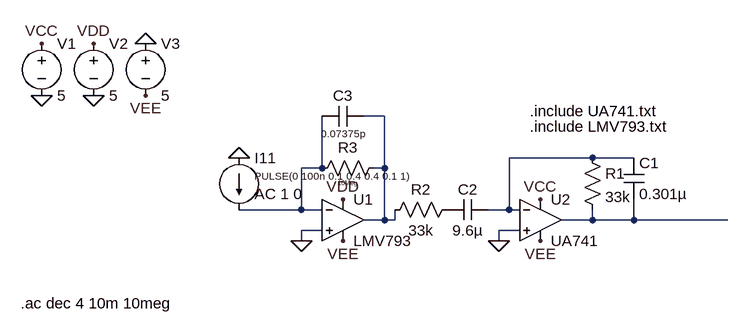
[diagram p0: schematic Draft1.asc]
Draft1.asc, the LTspice schematic file:
Version 4
SHEET 1 884 680
WIRE 112 16 80 16
WIRE 432 80 304 80
WIRE 496 80 432 80
WIRE 16 96 16 16
WIRE 16 96 -16 96
WIRE 112 96 112 16
WIRE 112 96 96 96
WIRE -16 160 -16 96
WIRE -16 160 -112 160
WIRE 16 160 -16 160
WIRE 304 160 304 80
WIRE 304 160 272 160
WIRE 320 160 304 160
WIRE 112 176 112 96
WIRE 112 176 80 176
WIRE 128 176 128 160
WIRE 128 176 112 176
WIRE 432 176 432 160
WIRE 432 176 384 176
WIRE 496 176 496 144
WIRE 496 176 432 176
WIRE 640 176 496 176
WIRE 16 192 -16 192
WIRE 320 192 288 192
WIRE -16 208 -16 192
WIRE 288 208 288 192
FLAG -16 208 0
FLAG 288 208 0
FLAG 48 208 VEE
FLAG 352 208 VEE
FLAG 48 144 VDD
FLAG 352 144 VCC
FLAG -416 -96 VCC
FLAG -336 -96 VDD
FLAG -256 -16 VEE
FLAG -416 -16 0
FLAG -336 -16 0
FLAG -256 -96 0
FLAG -112 80 0
SYMBOL Opamps\\opamp2 48 112 R0
SYMATTR InstName U1
SYMATTR Value LMV793
SYMBOL Opamps\\opamp2 352 112 R0
SYMATTR InstName U2
SYMATTR Value UA741
SYMBOL res 416 64 R0
SYMATTR InstName R1
SYMATTR Value 33k
SYMBOL cap 480 80 R0
SYMATTR InstName C1
SYMATTR Value 0.301µ
SYMBOL res 224 144 R90
WINDOW 0 0 56 VBottom 2
WINDOW 3 32 56 VTop 2
SYMATTR InstName R2
SYMATTR Value 33k
SYMBOL cap 272 144 R90
WINDOW 0 0 32 VBottom 2
WINDOW 3 32 32 VTop 2
SYMATTR InstName C2
SYMATTR Value 9.6µ
SYMBOL res 112 80 R90
WINDOW 0 0 56 VBottom 2
WINDOW 3 32 56 VTop 0
SYMATTR InstName R3
SYMATTR Value 10Meg
SYMBOL cap 80 0 R90
WINDOW 0 0 32 VBottom 2
WINDOW 3 32 32 VTop 1
SYMATTR InstName C3
SYMATTR Value 0.07375p
SYMBOL voltage -416 -112 R0
WINDOW 123 0 0 Left 0
WINDOW 39 0 0 Left 0
SYMATTR InstName V1
SYMATTR Value 5
SYMBOL voltage -336 -112 R0
WINDOW 123 0 0 Left 0
WINDOW 39 0 0 Left 0
SYMATTR InstName V2
SYMATTR Value 5
SYMBOL voltage -256 -112 R0
WINDOW 123 0 0 Left 0
WINDOW 39 0 0 Left 0
SYMATTR InstName V3
SYMATTR Value 5
SYMBOL current -112 80 R0
WINDOW 123 24 56 Left 2
WINDOW 39 0 0 Left 0
WINDOW 3 24 28 Left 1
SYMATTR Value2 AC 1 0
SYMATTR Value PULSE(0 100n 0.1 0.4 0.4 0.1 1)
SYMATTR InstName I11
TEXT 336 8 Left 2 !.include UA741.txt
TEXT 336 32 Left 2 !.include LMV793.txt
TEXT -448 304 Left 2 !.ac dec 4 10m 10meg

The netlist it stands for:
* Draft1.asc
XU1 0 N003 VDD VEE N001 LMV793  ; pins In+ In- V+ V- OUT
XU2 0 N002 VCC VEE N004 UA741  ; pins In+ In- V+ V- OUT
R1 N002 N004 33k
C1 N002 N004 0.301µ
R2 P001 N001 33k
C2 N002 P001 9.6µ
R3 N001 N003 10Meg
C3 N001 N003 0.07375p
V1 VCC 0 5
V2 VDD 0 5
V3 0 VEE 5
I11 0 N003 PULSE(0 100n 0.1 0.4 0.4 0.1 1) AC 1 0
.include UA741.txt
.include LMV793.txt
.ac dec 4 10m 10meg
.backanno
.end